# EasyEDA schematic 1-Schematic_GPIO_WAVER_18PIN.json
TITLE: Sheet_1; REV: 1.0; Date: 2024-07-22; Sheet: 1/1; Drawn By: maarnotto; Company: Your Company
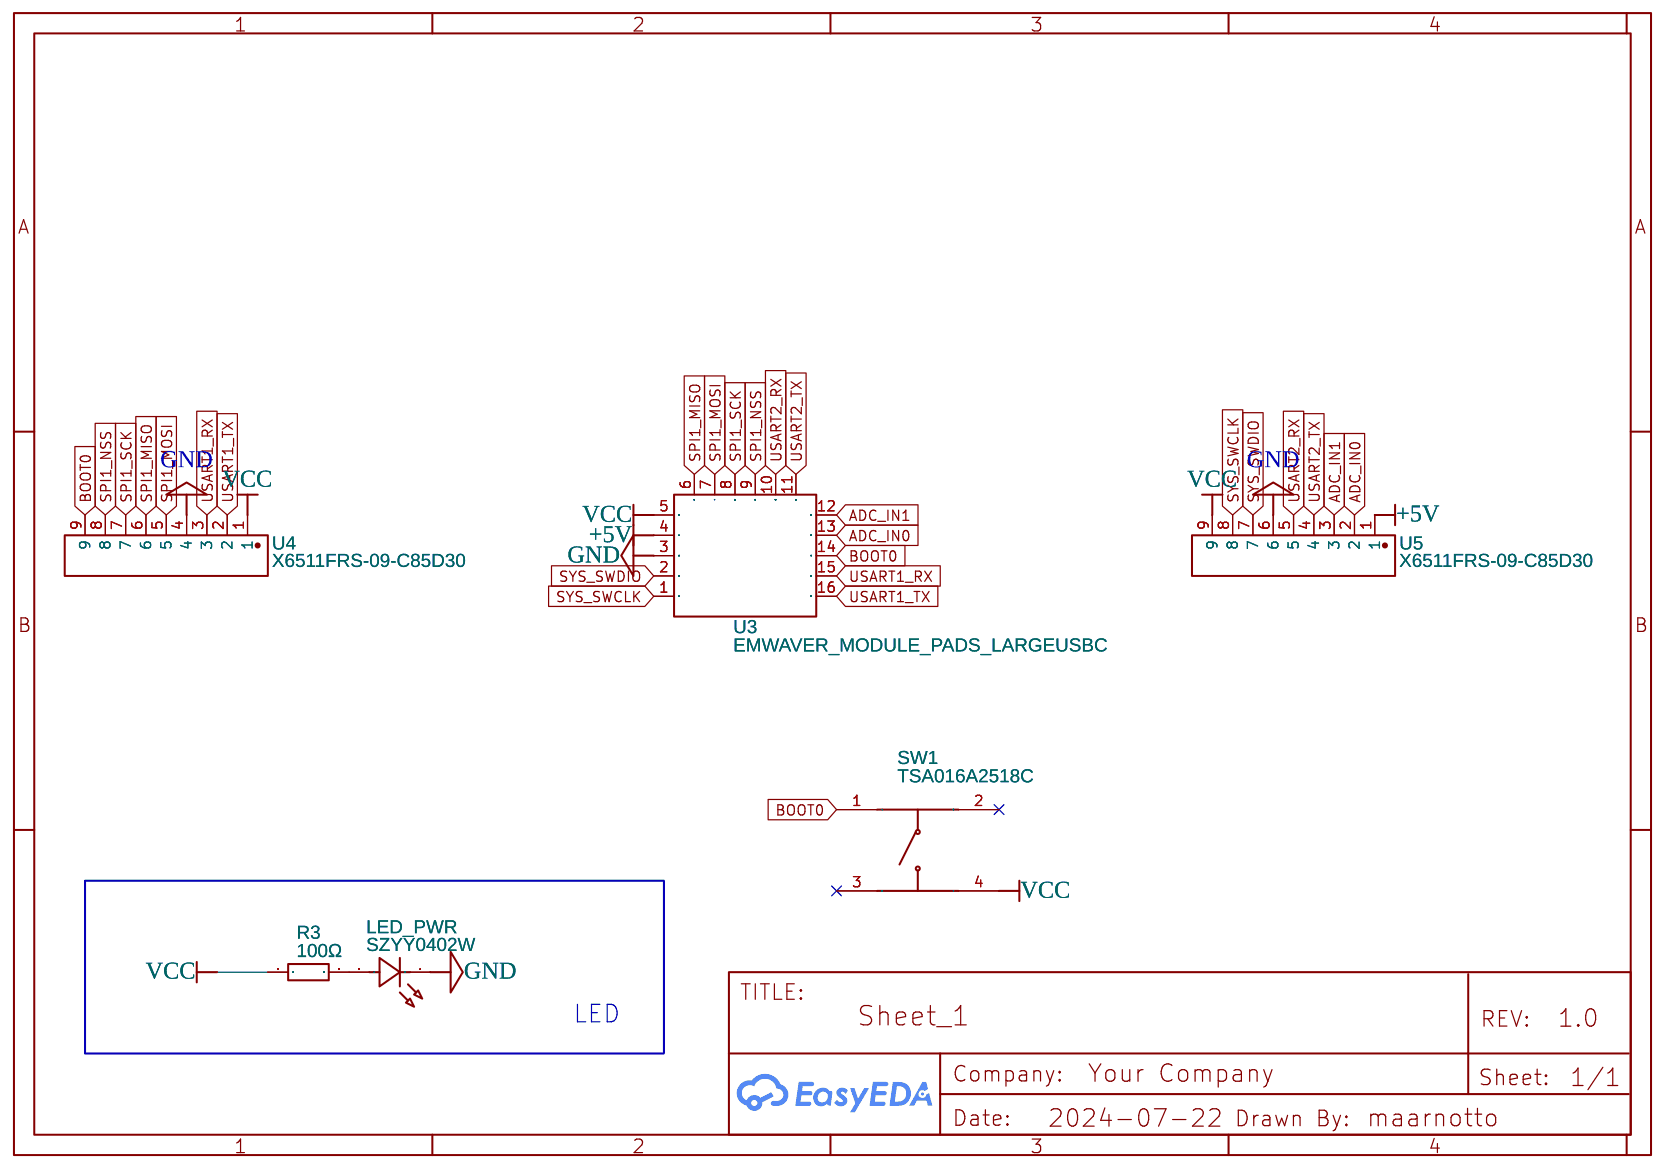
[diagram p0: schematic sheet]

## Parts
LED_PWR  SZYY0402W  [LED0402-RD_WHITE]
R3  100Ω  [R0402]
SW1  TSA016A2518C  [SW-SMD_4P-L4.2-W3.3-P2.15-LS4.6]
U3  EMWAVER_MODULE_PADS_LARGEUSBC  [EMWAVER_MODULE_PADS_FOOTPRINT_LARGEUSBC]
U4  X6511FRS-09-C85D30  [HDR-SMD_9P-P2.54-H-F-L11.5]
U5  X6511FRS-09-C85D30  [HDR-SMD_9P-P2.54-H-F-L11.5]

## Library data of the parts
LED_PWR = SZYY0402W: Contributor: lcsc; Supplier: LCSC; Supplier Part: C434448; Manufacturer: yongyu(永裕光电); JLCPCB Part Class: Extended Part
R3 = 0402WGF1000TCE: Supplier: LCSC; Manufacturer: UNI-ROYAL(厚声); Supplier Part: C25076; JLCPCB Part Class: Basic Part
SW1 = TSA016A2518C: Contributor: LCSC; Supplier: LCSC; Supplier Part: C2888430; Manufacturer: BZCN(博众电气); JLCPCB Part Class: Extended Part
U3 = EMWAVER_MODULE_PADS_LARGEUSBC: Contributor: maarnotto
U4 U5 = X6511FRS-09-C85D30: Contributor: lcsc; Supplier: LCSC; Supplier Part: C5142242; Manufacturer: XKB Connectivity(中国星坤); JLCPCB Part Class: Extended Part

## Nets
+5V: U3.4 U5.1
GND: LED_PWR.1(K) U3.3 U4.4 U5.6
VCC: R3.1 SW1.4 U3.5 U4.1 U5.9
ADC_IN0: U3.13 U5.2
ADC_IN1: U3.12 U5.3
BOOT0: SW1.1 U3.14 U4.9
SPI1_MISO: U3.6 U4.6
SPI1_MOSI: U3.7 U4.5
SPI1_NSS: U3.9 U4.8
SPI1_SCK: U3.8 U4.7
SYS_SWCLK: U3.1 U5.8
SYS_SWDIO: U3.2 U5.7
USART1_RX: U3.15 U4.3
USART1_TX: U3.16 U4.2
USART2_RX: U3.10 U5.5
USART2_TX: U3.11 U5.4
Net-(LED_PWR-2): LED_PWR.2(A) R3.2

Not connected (* = marked no-connect by the designer): SW1 2* 3*

## Notes on the sheet
- LED
